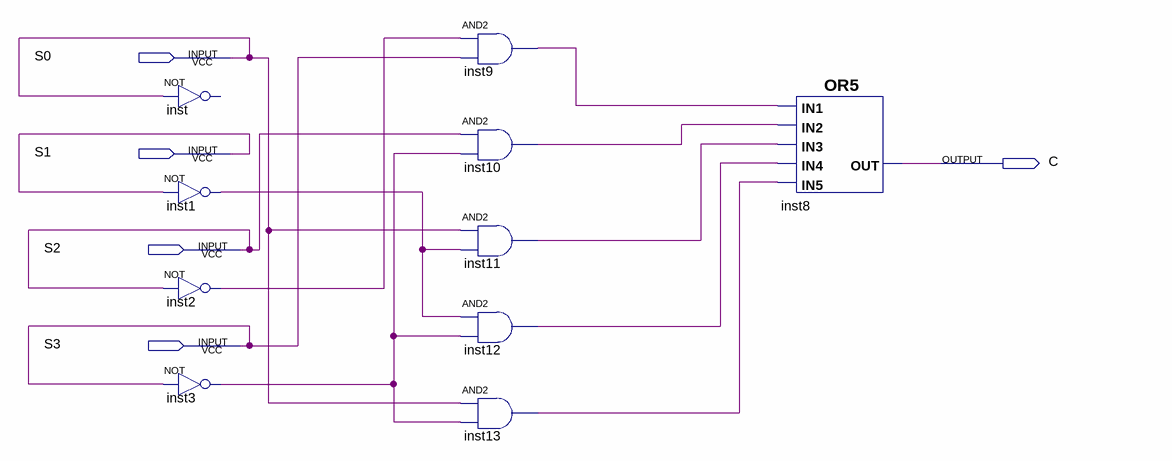
[diagram p0: schematic sheet]
// Quartus schematic C-nda2_3.bdf as structural Verilog: 10 symbols, 5 pins
module \C-nda2_3  (
  input  S0,
  input  S1,
  input  S2,
  input  S3,
  output C
);

  wire inst1_out, inst2_out, inst3_out, inst9_out, inst10_out, inst11_out, inst12_out, inst13_out;

  // NOT inst has open pins: IN=S0, OUT=open
  not inst1 (inst1_out, S1);
  not inst2 (inst2_out, S2);
  not inst3 (inst3_out, S3);
  and inst9 (inst9_out, inst2_out, S3);
  and inst10 (inst10_out, S2, inst3_out);
  and inst11 (inst11_out, S0, inst1_out);
  and inst12 (inst12_out, inst1_out, inst3_out);
  and inst13 (inst13_out, S0, inst3_out);
  or inst8 (C, inst9_out, inst10_out, inst11_out, inst12_out, inst13_out);
endmodule
